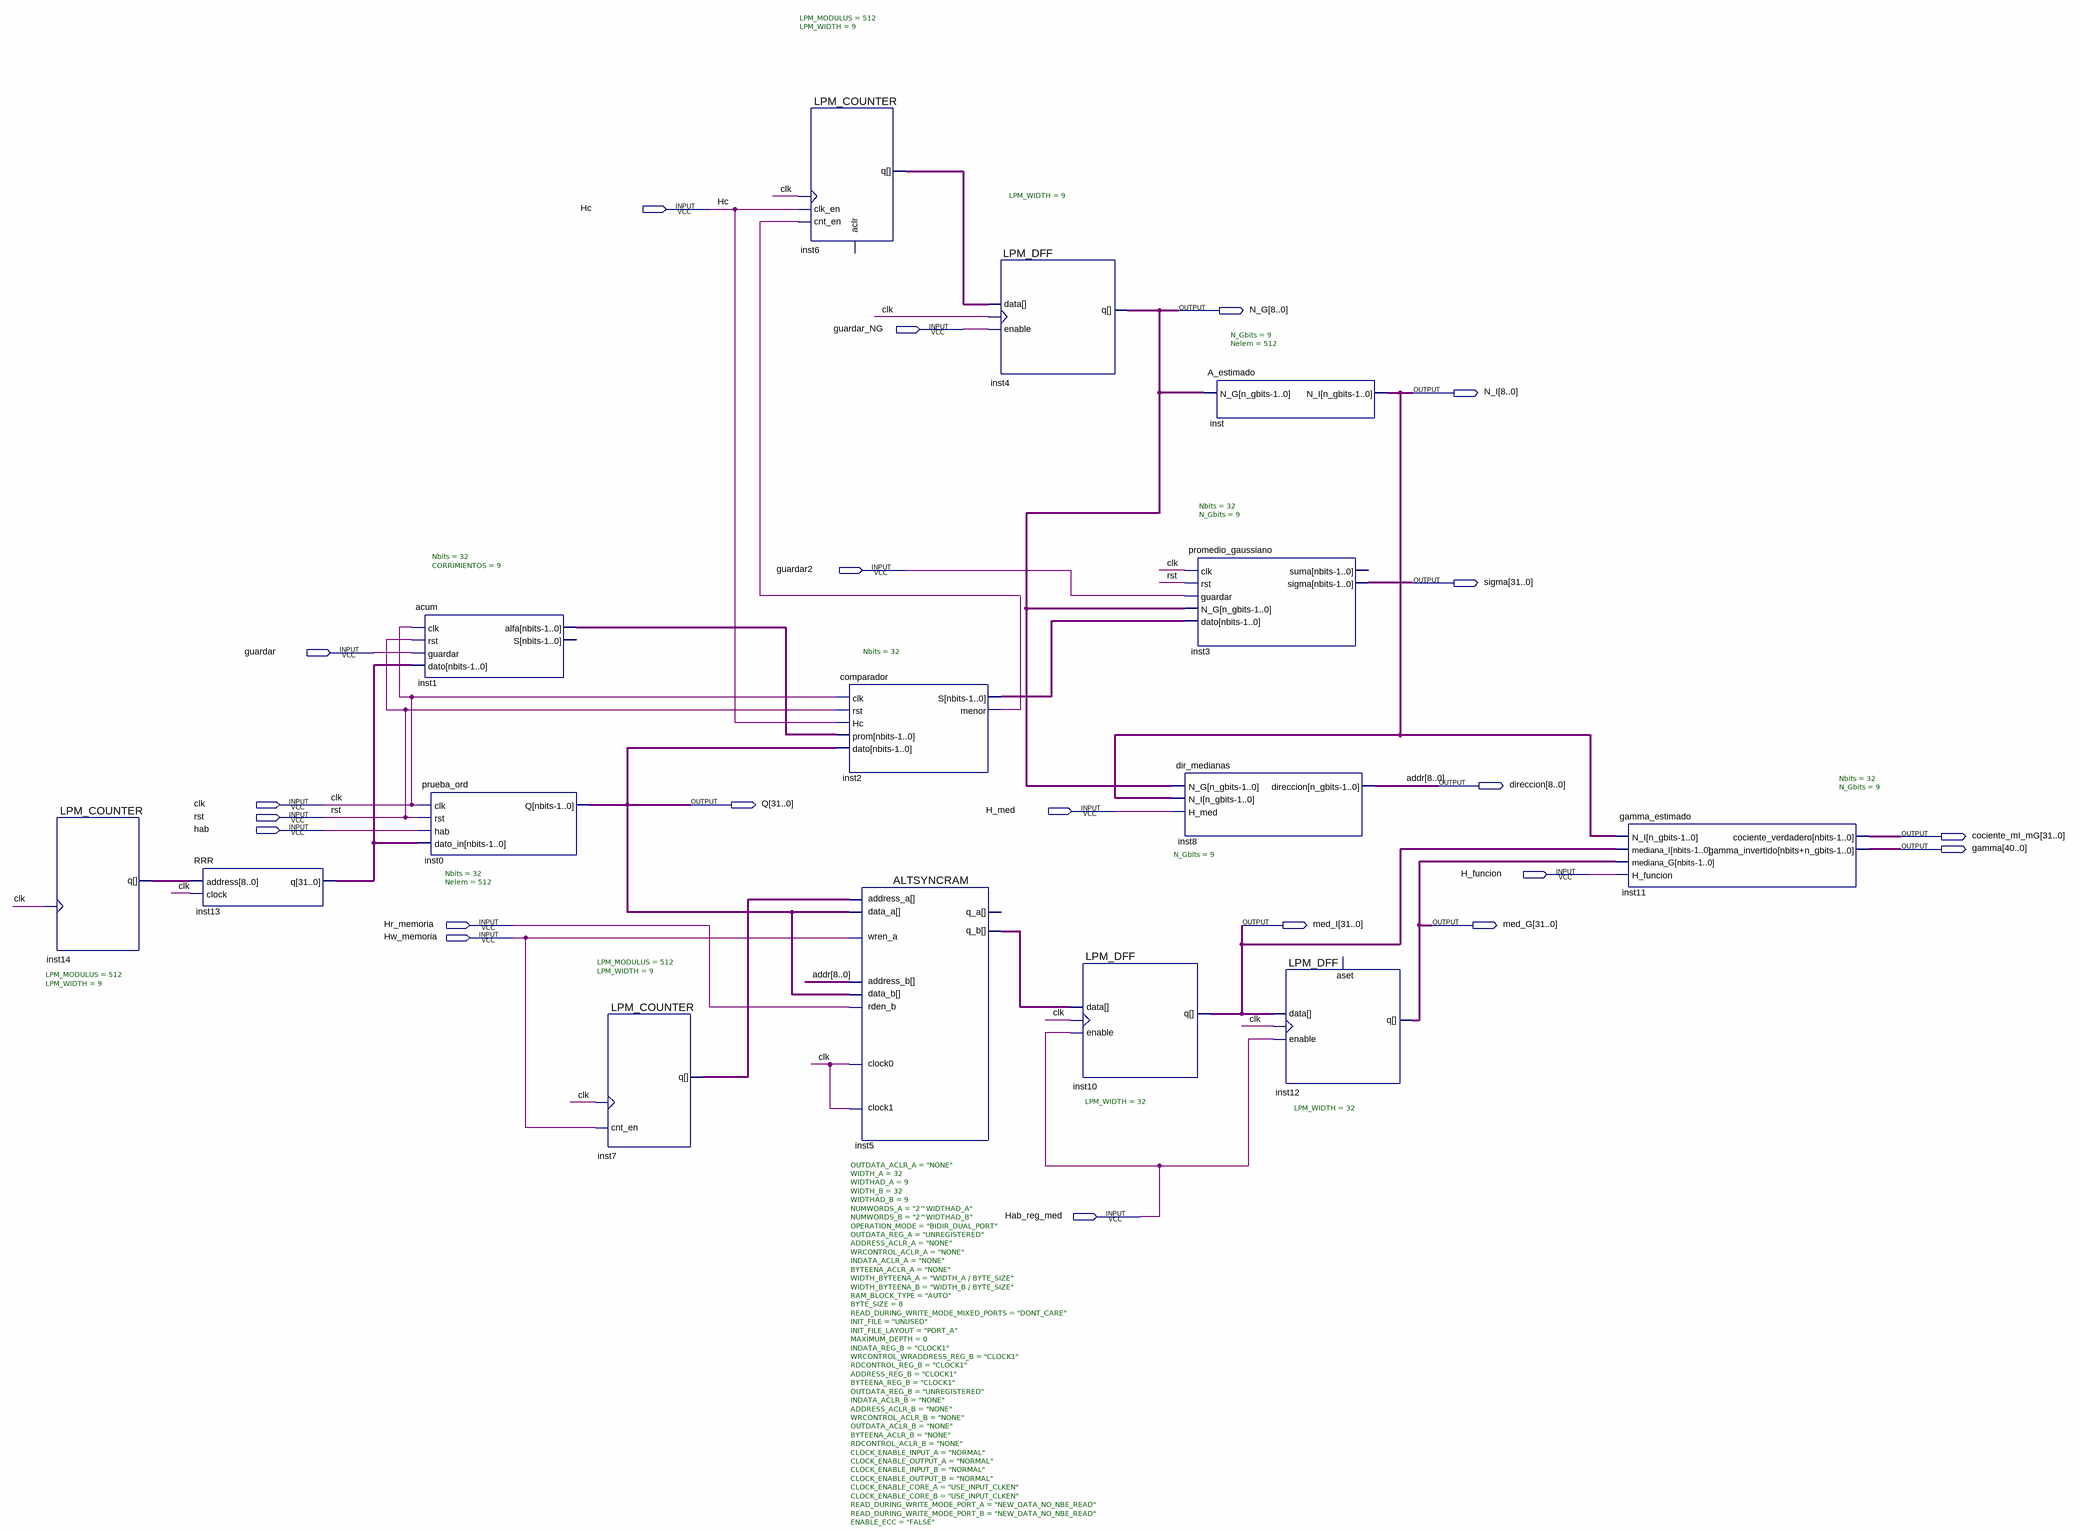
[diagram p0: schematic sheet]
// Quartus schematic estimador.bdf as structural Verilog: 15 symbols, 21 pins
module estimador (
  input  Hc,
  input  guardar_NG,
  input  guardar2,
  input  guardar,
  input  clk,
  input  H_med,
  input  rst,
  input  hab,
  input  H_funcion,
  input  Hr_memoria,
  input  Hw_memoria,
  input  Hab_reg_med,
  output [8:0] N_G,
  output [8:0] N_I,
  output [31:0] sigma,
  output [8:0] direccion,
  output [31:0] Q,
  output [31:0] cociente_mI_mG,
  output [40:0] gamma,
  output [31:0] med_I,
  output [31:0] med_G
);

  wire inst2_menor;
  wire [8:0] inst6_q, inst7_q, inst14_q;
  wire [31:0] inst1_alfa, inst2_s, inst5_q_b, inst13_q;

  LPM_COUNTER #(.LPM_MODULUS(512), .LPM_WIDTH(9)) inst14 (.clock(clk), .q(inst14_q));
  RRR inst13 (.address(inst14_q), .clock(clk), .q(inst13_q));
  acum #(.Nbits(32), .CORRIMIENTOS(9)) inst1 (
    .clk(clk), .rst(rst), .guardar(guardar), .dato(inst13_q), .alfa(inst1_alfa));  // open: S
  prueba_ord #(.Nbits(32), .Nelem(512)) inst0 (.clk(clk), .rst(rst), .hab(hab), .dato_in(inst13_q), .Q(Q));
  LPM_COUNTER #(.LPM_MODULUS(512), .LPM_WIDTH(9)) inst7 (.clock(clk), .cnt_en(Hw_memoria), .q(inst7_q));
  LPM_COUNTER #(.LPM_MODULUS(512), .LPM_WIDTH(9)) inst6 (
    .clk_en(Hc), .clock(clk), .cnt_en(inst2_menor), .q(inst6_q));  // open: aclr
  comparador #(.Nbits(32)) inst2 (
    .clk(clk), .rst(rst), .Hc(Hc), .prom(inst1_alfa), .dato(Q), .S(inst2_s), .menor(inst2_menor));
  ALTSYNCRAM #(.OUTDATA_ACLR_A("NONE"), .WIDTH_A(32), .WIDTHAD_A(9), .WIDTH_B(32), .WIDTHAD_B(9), .NUMWORDS_A("2^WIDTHAD_A"), .NUMWORDS_B("2^WIDTHAD_B"), .OPERATION_MODE("BIDIR_DUAL_PORT"), .OUTDATA_REG_A("UNREGISTERED"), .ADDRESS_ACLR_A("NONE"), .WRCONTROL_ACLR_A("NONE"), .INDATA_ACLR_A("NONE"), .BYTEENA_ACLR_A("NONE"), .WIDTH_BYTEENA_A("WIDTH_A / BYTE_SIZE"), .WIDTH_BYTEENA_B("WIDTH_B / BYTE_SIZE"), .RAM_BLOCK_TYPE("AUTO"), .BYTE_SIZE(8), .READ_DURING_WRITE_MODE_MIXED_PORTS("DONT_CARE"), .INIT_FILE("UNUSED"), .INIT_FILE_LAYOUT("PORT_A"), .MAXIMUM_DEPTH(0), .INDATA_REG_B("CLOCK1"), .WRCONTROL_WRADDRESS_REG_B("CLOCK1"), .RDCONTROL_REG_B("CLOCK1"), .ADDRESS_REG_B("CLOCK1"), .BYTEENA_REG_B("CLOCK1"), .OUTDATA_REG_B("UNREGISTERED"), .INDATA_ACLR_B("NONE"), .ADDRESS_ACLR_B("NONE"), .WRCONTROL_ACLR_B("NONE"), .OUTDATA_ACLR_B("NONE"), .BYTEENA_ACLR_B("NONE"), .RDCONTROL_ACLR_B("NONE"), .CLOCK_ENABLE_INPUT_A("NORMAL"), .CLOCK_ENABLE_OUTPUT_A("NORMAL"), .CLOCK_ENABLE_INPUT_B("NORMAL"), .CLOCK_ENABLE_OUTPUT_B("NORMAL"), .CLOCK_ENABLE_CORE_A("USE_INPUT_CLKEN"), .CLOCK_ENABLE_CORE_B("USE_INPUT_CLKEN"), .READ_DURING_WRITE_MODE_PORT_A("NEW_DATA_NO_NBE_READ"), .READ_DURING_WRITE_MODE_PORT_B("NEW_DATA_NO_NBE_READ"), .ENABLE_ECC("FALSE")) inst5 (
    .address_a(inst7_q), .address_b(direccion), .clock0(clk), .clock1(clk), .data_a(Q), .data_b(Q),
    .rden_b(Hr_memoria), .wren_a(Hw_memoria), .q_b(inst5_q_b));  // open: q_a
  LPM_DFF #(.LPM_WIDTH(9)) inst4 (.clock(clk), .data(inst6_q), .enable(guardar_NG), .q(N_G));
  LPM_DFF #(.LPM_WIDTH(32)) inst10 (.clock(clk), .data(inst5_q_b), .enable(Hab_reg_med), .q(med_I));
  A_estimado #(.N_Gbits(9), .Nelem(512)) inst (.N_G(N_G), .N_I(N_I));
  promedio_gaussiano #(.Nbits(32), .N_Gbits(9)) inst3 (
    .clk(clk), .rst(rst), .guardar(guardar2), .N_G(N_G), .dato(inst2_s), .sigma(sigma));  // open: suma
  dir_medianas #(.N_Gbits(9)) inst8 (.N_G(N_G), .N_I(N_I), .H_med(H_med), .direccion(direccion));
  LPM_DFF #(.LPM_WIDTH(32)) inst12 (.clock(clk), .data(med_I), .enable(Hab_reg_med), .q(med_G));  // open: aset
  gamma_estimado #(.Nbits(32), .N_Gbits(9)) inst11 (
    .N_I(N_I), .mediana_I(med_I), .mediana_G(med_G), .H_funcion(H_funcion),
    .cociente_verdadero(cociente_mI_mG), .gamma_invertido(gamma));

  // Other names for the same wires on the sheet: addr[8:0] = direccion
endmodule
